# Altium schematic sheet Sheet2.SchDoc
size A3
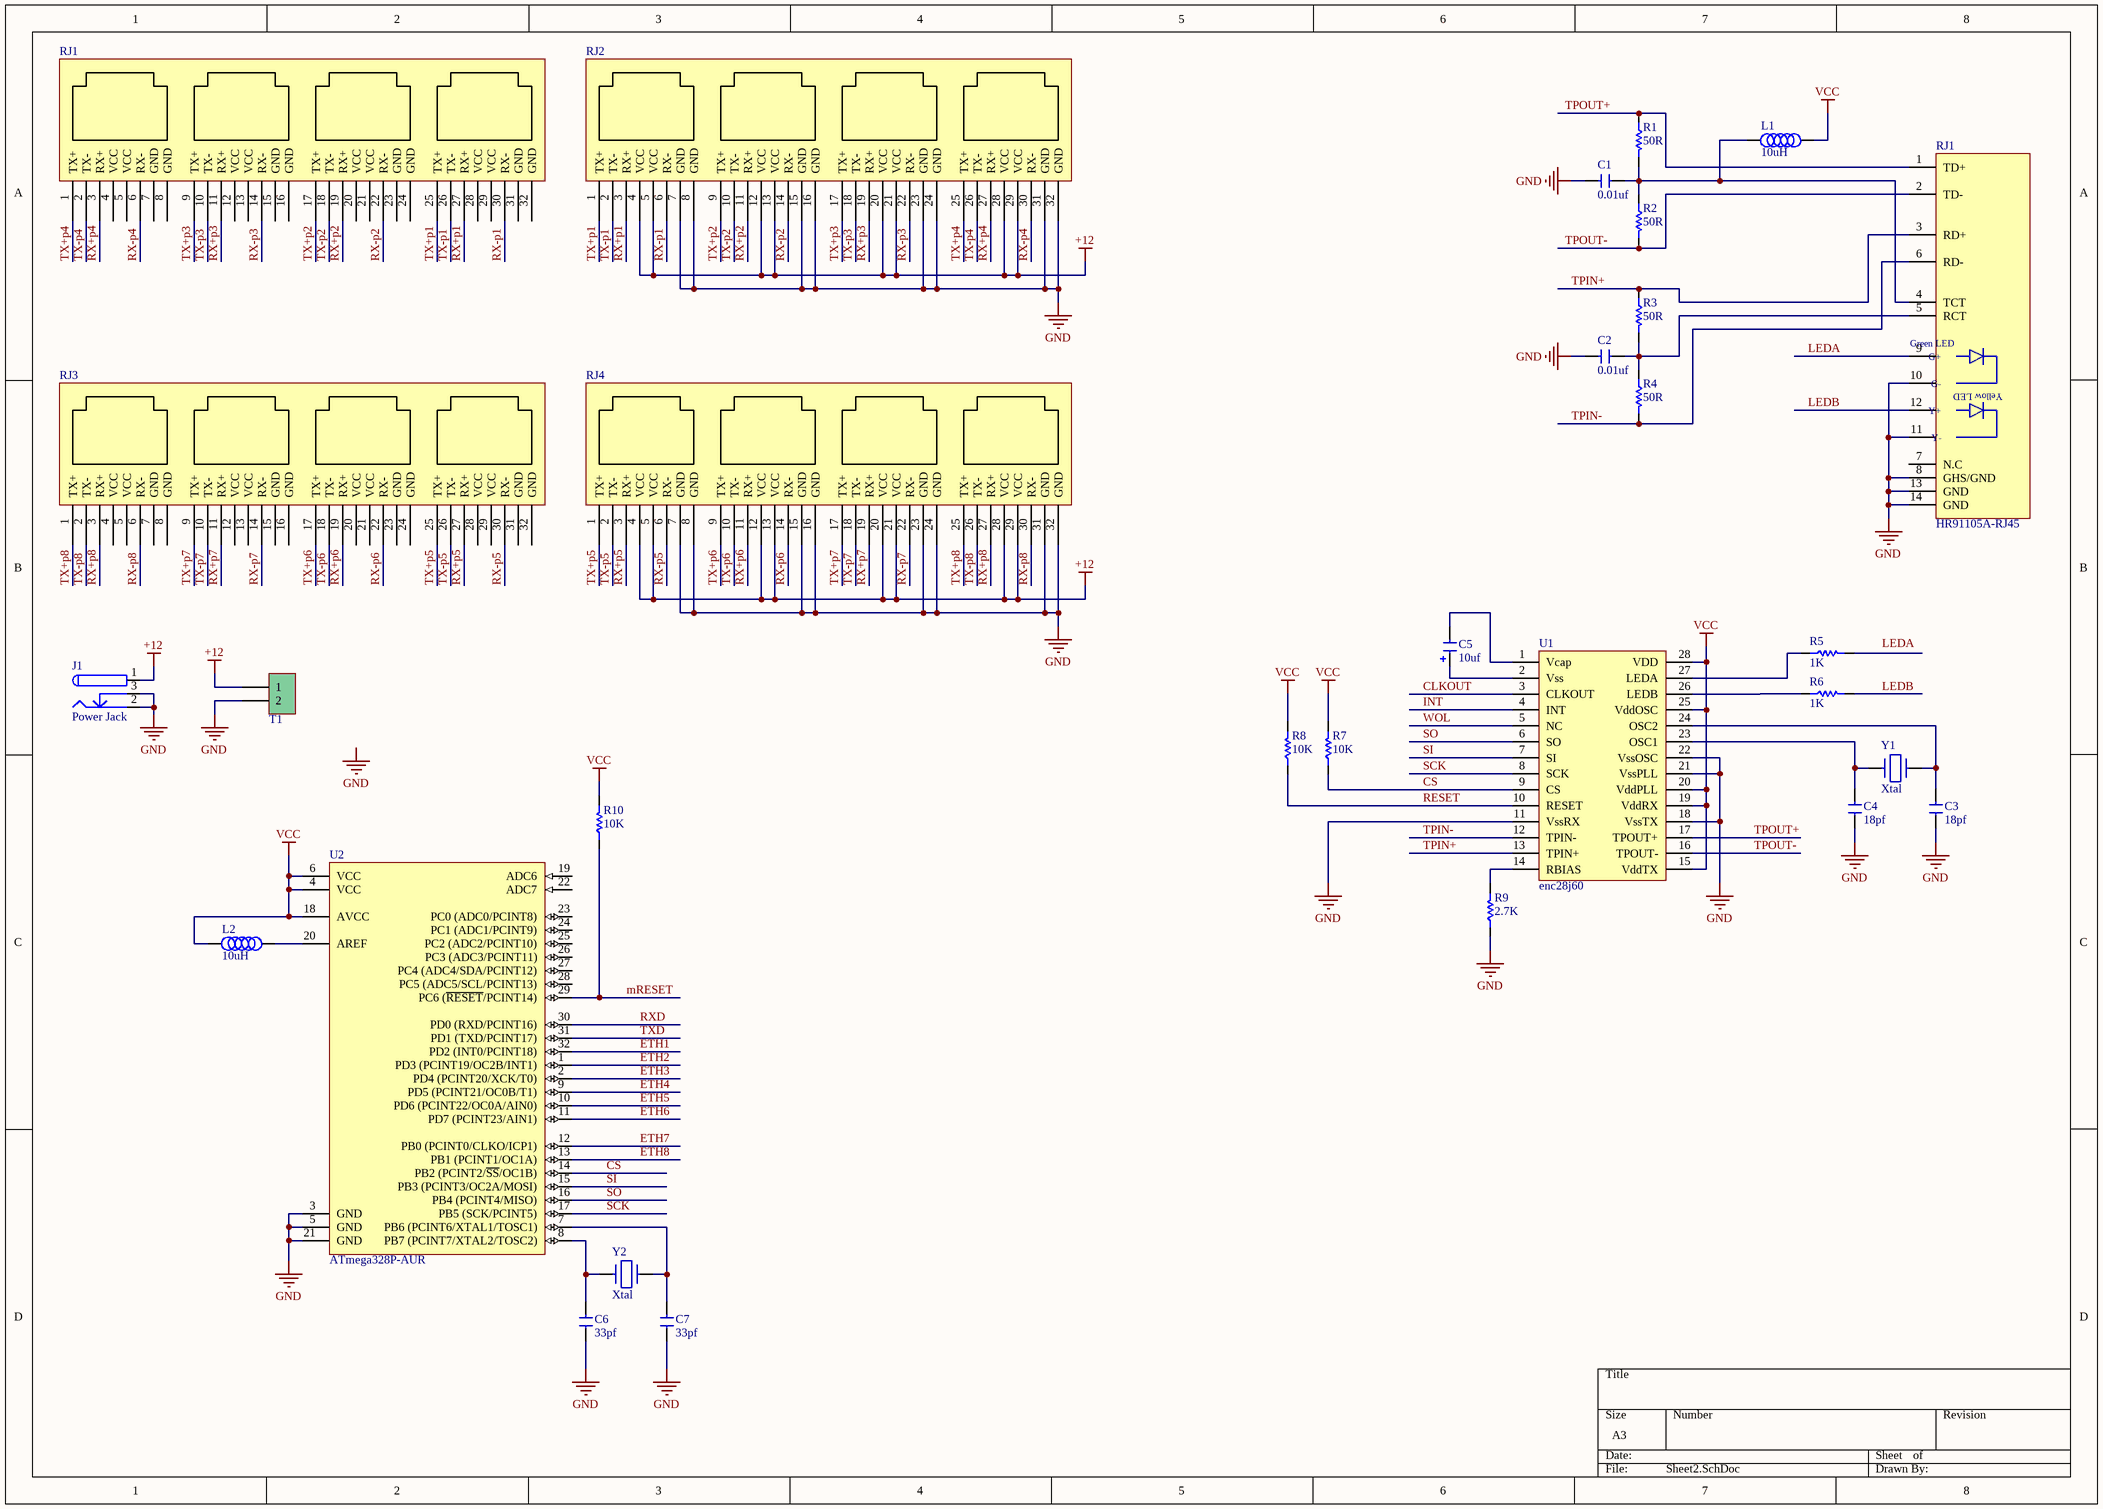
[diagram p0: Sheet2.SchDoc]

## Parts
(Parts that share a designator on the sheet are numbered #1, #2 ... from top to bottom, then left to right.)
C1  Capacitor SMD  [1206 Capacitor]  (value not drawn)
C2  Capacitor SMD  [1206 Capacitor]  (value not drawn)
C3  Capacitor SMD  [1206 Capacitor]  (value not drawn)
C4  Capacitor SMD  [1206 Capacitor]  (value not drawn)
C5  10uf  [Tantalium Size A]
C6  Capacitor SMD  [1206 Capacitor]  (value not drawn)
C7  Capacitor SMD  [1206 Capacitor]  (value not drawn)
J1  Power Jack  [Power Jack]
L1  10uH  [Inductor 1210(3225)]
L2  10uH  [Inductor 1210(3225)]
R1  50R  [RES 1206 (3216X08L)]
R2  50R  [RES 1206 (3216X08L)]
R3  50R  [RES 1206 (3216X08L)]
R4  50R  [RES 1206 (3216X08L)]
R5  1K  [RES 1206 (3216X08L)]
R6  1K  [RES 1206 (3216X08L)]
R7  10K  [RES 1206 (3216X08L)]
R8  10K  [RES 1206 (3216X08L)]
R9  2.7K  [RES 1206 (3216X08L)]
R10  10K  [RES 1206 (3216X08L)]
RJ1#1  (no value)  [rj45-w57-4]
RJ1#2  HR91105A-RJ45  [HR91105A-RJ45]
RJ2  (no value)  [rj45-w57-4]
RJ3  (no value)  [rj45-w57-4]
RJ4  (no value)  [rj45-w57-4]
T1  Phoenix terminal  [phoenix terminal 2]  (value not drawn)
U1  enc28j60  [SOIC127P1030X265-28N]
U2  ATmega328P-AUR  [32A_N]
Y1  Xtal  [Crystal SMD]
Y2  Xtal  [Crystal SMD]

## Nets
+12: J1.1 RJ2.4(VCC) RJ2.5(VCC) RJ2.12(VCC) RJ2.13(VCC) RJ2.20(VCC) RJ2.21(VCC) RJ2.28(VCC) RJ2.29(VCC) RJ4.4(VCC) RJ4.5(VCC) RJ4.12(VCC) RJ4.13(VCC) RJ4.20(VCC) RJ4.21(VCC) RJ4.28(VCC) RJ4.29(VCC) T1.1
GND: C1.1 C2.1 C3.1 C4.1 C6.1 C7.1 J1.2 J1.3 R9.1 RJ1#2.8(GHS/GND) RJ1#2.10 RJ1#2.11 RJ1#2.13(GND) RJ1#2.14(GND) RJ2.7(GND) RJ2.8(GND) RJ2.15(GND) RJ2.16(GND) RJ2.23(GND) RJ2.24(GND) RJ2.31(GND) RJ2.32(GND) RJ4.7(GND) RJ4.8(GND) RJ4.15(GND) RJ4.16(GND) RJ4.23(GND) RJ4.24(GND) RJ4.31(GND) RJ4.32(GND) T1.2 U1.11(VssRX) U1.18(VssTX) U1.21(VssPLL) U1.22(VssOSC) U2.3(GND) U2.5(GND) U2.21(GND)
VCC: L1.2 L2.1 R7.2 R8.2 R10.2 U1.15(VddTX) U1.19(VddRX) U1.20(VddPLL) U1.25(VddOSC) U1.28(VDD) U2.4(VCC) U2.6(VCC) U2.18(AVCC)
CLKOUT: U1.3(CLKOUT)
CS: R7.1 U1.9(CS) U2.14(PB2_(PCINT2/~{SS}/OC1B))
ETH1: U2.32(PD2_(INT0/PCINT18))
ETH2: U2.1(PD3_(PCINT19/OC2B/INT1))
ETH3: U2.2(PD4_(PCINT20/XCK/T0))
ETH4: U2.9(PD5_(PCINT21/OC0B/T1))
ETH5: U2.10(PD6_(PCINT22/OC0A/AIN0))
ETH6: U2.11(PD7_(PCINT23/AIN1))
ETH7: U2.12(PB0_(PCINT0/CLKO/ICP1))
ETH8: U2.13(PB1_(PCINT1/OC1A))
INT: U1.4(INT)
LEDA: RJ1#2.9
LEDB: R6.2 RJ1#2.12
mRESET: R10.1 U2.29(PC6_(~{RESET}/PCINT14))
RESET: R8.1 U1.10(RESET)
RX+p1: RJ1#1.27(RX+) RJ2.3(RX+)
RX+p2: RJ1#1.19(RX+) RJ2.11(RX+)
RX+p3: RJ1#1.11(RX+) RJ2.19(RX+)
RX+p4: RJ1#1.3(RX+) RJ2.27(RX+)
RX+p5: RJ3.27(RX+) RJ4.3(RX+)
RX+p6: RJ3.19(RX+) RJ4.11(RX+)
RX+p7: RJ3.11(RX+) RJ4.19(RX+)
RX+p8: RJ3.3(RX+) RJ4.27(RX+)
RX-p1: RJ1#1.30(RX-) RJ2.6(RX-)
RX-p2: RJ1#1.22(RX-) RJ2.14(RX-)
RX-p3: RJ1#1.14(RX-) RJ2.22(RX-)
RX-p4: RJ1#1.6(RX-) RJ2.30(RX-)
RX-p5: RJ3.30(RX-) RJ4.6(RX-)
RX-p6: RJ3.22(RX-) RJ4.14(RX-)
RX-p7: RJ3.14(RX-) RJ4.22(RX-)
RX-p8: RJ3.6(RX-) RJ4.30(RX-)
RXD: U2.30(PD0_(RXD/PCINT16))
SCK: U1.8(SCK) U2.17(PB5_(SCK/PCINT5))
SI: U1.7(SI) U2.15(PB3_(PCINT3/OC2A/MOSI))
SO: U1.6(SO) U2.16(PB4_(PCINT4/MISO))
TPIN+: R3.1 RJ1#2.3(RD+) U1.13(TPIN+)
TPIN-: R4.2 RJ1#2.6(RD-) U1.12(TPIN-)
TPOUT+: R1.1 RJ1#2.1(TD+) U1.17(TPOUT+)
TPOUT-: R2.2 RJ1#2.2(TD-) U1.16(TPOUT-)
TX+p1: RJ1#1.25(TX+) RJ2.1(TX+)
TX+p2: RJ1#1.17(TX+) RJ2.9(TX+)
TX+p3: RJ1#1.9(TX+) RJ2.17(TX+)
TX+p4: RJ1#1.1(TX+) RJ2.25(TX+)
TX+p5: RJ3.25(TX+) RJ4.1(TX+)
TX+p6: RJ3.17(TX+) RJ4.9(TX+)
TX+p7: RJ3.9(TX+) RJ4.17(TX+)
TX+p8: RJ3.1(TX+) RJ4.25(TX+)
TX-p1: RJ1#1.26(TX-) RJ2.2(TX-)
TX-p2: RJ1#1.18(TX-) RJ2.10(TX-)
TX-p3: RJ1#1.10(TX-) RJ2.18(TX-)
TX-p4: RJ1#1.2(TX-) RJ2.26(TX-)
TX-p5: RJ3.26(TX-) RJ4.2(TX-)
TX-p6: RJ3.18(TX-) RJ4.10(TX-)
TX-p7: RJ3.10(TX-) RJ4.18(TX-)
TX-p8: RJ3.2(TX-) RJ4.26(TX-)
TXD: U2.31(PD1_(TXD/PCINT17))
WOL: U1.5(NC)
NetC1_2: C1.2 L1.1 R1.2 R2.1 RJ1#2.4(TCT)
NetC2_2: C2.2 R3.2 R4.1 RJ1#2.5(RCT)
NetC3_2: C3.2 U1.24(OSC2) Y1.1
NetC4_2: C4.2 U1.23(OSC1) Y1.2
NetC5_1: C5.1 U1.2(Vss)
NetC5_2: C5.2 U1.1(Vcap)
NetC6_2: C6.2 U2.8(PB7_(PCINT7/XTAL2/TOSC2)) Y2.2
NetC7_2: C7.2 U2.7(PB6_(PCINT6/XTAL1/TOSC1)) Y2.1
NetL2_2: L2.2 U2.20(AREF)
NetR5_1: R5.1 U1.27(LEDA)
NetR6_1: R6.1 U1.26(LEDB)
NetR9_2: R9.2 U1.14(RBIAS)

Not connected (* = marked no-connect by the designer): R5 2; RJ1#1 4(VCC) 5(VCC) 7(GND) 8(GND) 12(VCC) 13(VCC) 15(GND) 16(GND) 20(VCC) 21(VCC) 23(GND) 24(GND) 28(VCC) 29(VCC) 31(GND) 32(GND); RJ1#2 7(N.C); RJ3 4(VCC) 5(VCC) 7(GND) 8(GND) 12(VCC) 13(VCC) 15(GND) 16(GND) 20(VCC) 21(VCC) 23(GND) 24(GND) 28(VCC) 29(VCC) 31(GND) 32(GND); U2 19(ADC6) 22(ADC7) 23(PC0_(ADC0/PCINT8)) 24(PC1_(ADC1/PCINT9)) 25(PC2_(ADC2/PCINT10)) 26(PC3_(ADC3/PCINT11)) 27(PC4_(ADC4/SDA/PCINT12)) 28(PC5_(ADC5/SCL/PCINT13))

## Notes on the sheet
- Labels drawn without touching a wire or pin: GND, LEDA
- (in symbol Capacitor SMD) 0.01uf; 18pf; 33pf
- (in symbol HR911105A) Green LED; G+; G-; Yellow LED; Y+; Y-

## Library data of the parts
C5 = Capacitor Tantalium
J1 = Power Jack: Designer: Saeid Jorablo; Company: Personal; Project Name: Laser; Adding Date: 10/21/2009
L1 L2 = Inductor SMT
R1-R10 = Resistor: Tolerance: 5%; Power: 1/8 W
  R1-R4: Value: 50R
  R5 R6: Value: 1K
  R7 R8 R10: Value: 10K
  R9: Value: 2.7K
RJ1#1 RJ2-RJ4 = RJ45-w57-4
RJ1#2 = HR911105A
T1 = Phoenix terminal 2: Terminal 2 Pin; Designer: Seyed Mohsen Ghasemain; E-mail: picpars@gmail.com; ComponentLinkURL: www.picpars.com
U2 = ATmega328P-AUR: 8-bit AVR Microcontroller, 32KB Flash, 1KB EEPROM, 2KB SRAM, 32-pin TQFP, Industrial Grade (-40°C to 85°C); Published: 1-Apr-2010; DatasheetVersion: revA, Jan-2010; PackageVersion: revB, Oct-2001; PackageReference: 32A; Publisher: Altium Limited; PackageDescription: 32-Lead, 7x7x1.0 mm Body, 0.8mm Lead Pitch, Thin Profile Plastic Quad Flat Package (TQFP); Supplier 1: Digi-Key; Supplier Part Number 1: ATMEGA328P-AUR-ND; Supplier 2: Mouser; Supplier Part Number 2: 556-ATMEGA328P-AUR; Code_JEDEC: MS-026-ABA; ComponentLink1Description: Manufacturer Link; ComponentLink1URL: http://www.atmel.com/products/avr/default.asp?; ComponentLink2Description: ATmega48A/48PA/88A/88PA/168A/168PA/328/328P Datasheet; ComponentLink2URL: http://www.atmel.com/dyn/resources/prod_documents/8271.pdf; ComponentLink3Description: ATmega48A/48PA/88A/88PA/168A/168PA/328/328P Summary; ComponentLink3URL: http://www.atmel.com/dyn/resources/prod_documents/8271S.pdf; ComponentLink4Description: Atmel.com Home; ComponentLink4URL: http://www.atmel.com